# Altium schematic sheet dac.SchDoc: KART : IO OPTO
size A4; DrawnBy: JNieto; DocumentNumber: 4; Revision: 1.0; SheetNumber: 4; SheetTotal: 4; Version: V 1.0.0
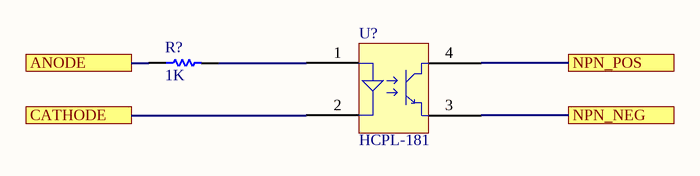
[diagram p0: dac.SchDoc]

## Parts
R?  value 1K  [R0603]
U?  HCPL-181  [SOIC-4]

## Ports
ANODE, CATHODE, NPN_NEG, NPN_POS

## Nets
ANODE: R?.1 ; port ANODE
CATHODE: U?.2 ; port CATHODE
NPN_NEG: U?.3 ; port NPN_NEG
NPN_POS: U?.4 ; port NPN_POS
NetR?_2: R?.2 U?.1

## Library data of the parts
R? = MCD-00220: Resistor,1K,0603,1%,1/10W; Manufacturer_Part_Number: RC0603FR-0710KL; Manufacturer: YAGEO; Provided_By: Subcon; Initial_Board_Reference: MB1319; Internal_Part_Number: MCD-00220; Status: Released; Part_Type: Resistor; ComponentLink1Description: Datasheet; ECCN_US: n/a; ECCN_EU: n/a; Package: R0603; ComponentLink1URL: http://tunmcdsvn.tun.st.com/Component_Datasheet_Library/Trunk/Resistors/Yageo_Resistor_RC0603-series
U? = HCPL-181: Optoacoplador